# EasyEDA schematic Class D Audio Amplifier on TPA3255 ChipDip.json
TITLE: Sheet_1; REV: 1.0; Date: 2019-03-31; Sheet: 1/1; Drawn By: Dmitry-Chernikov; Company: Your Company
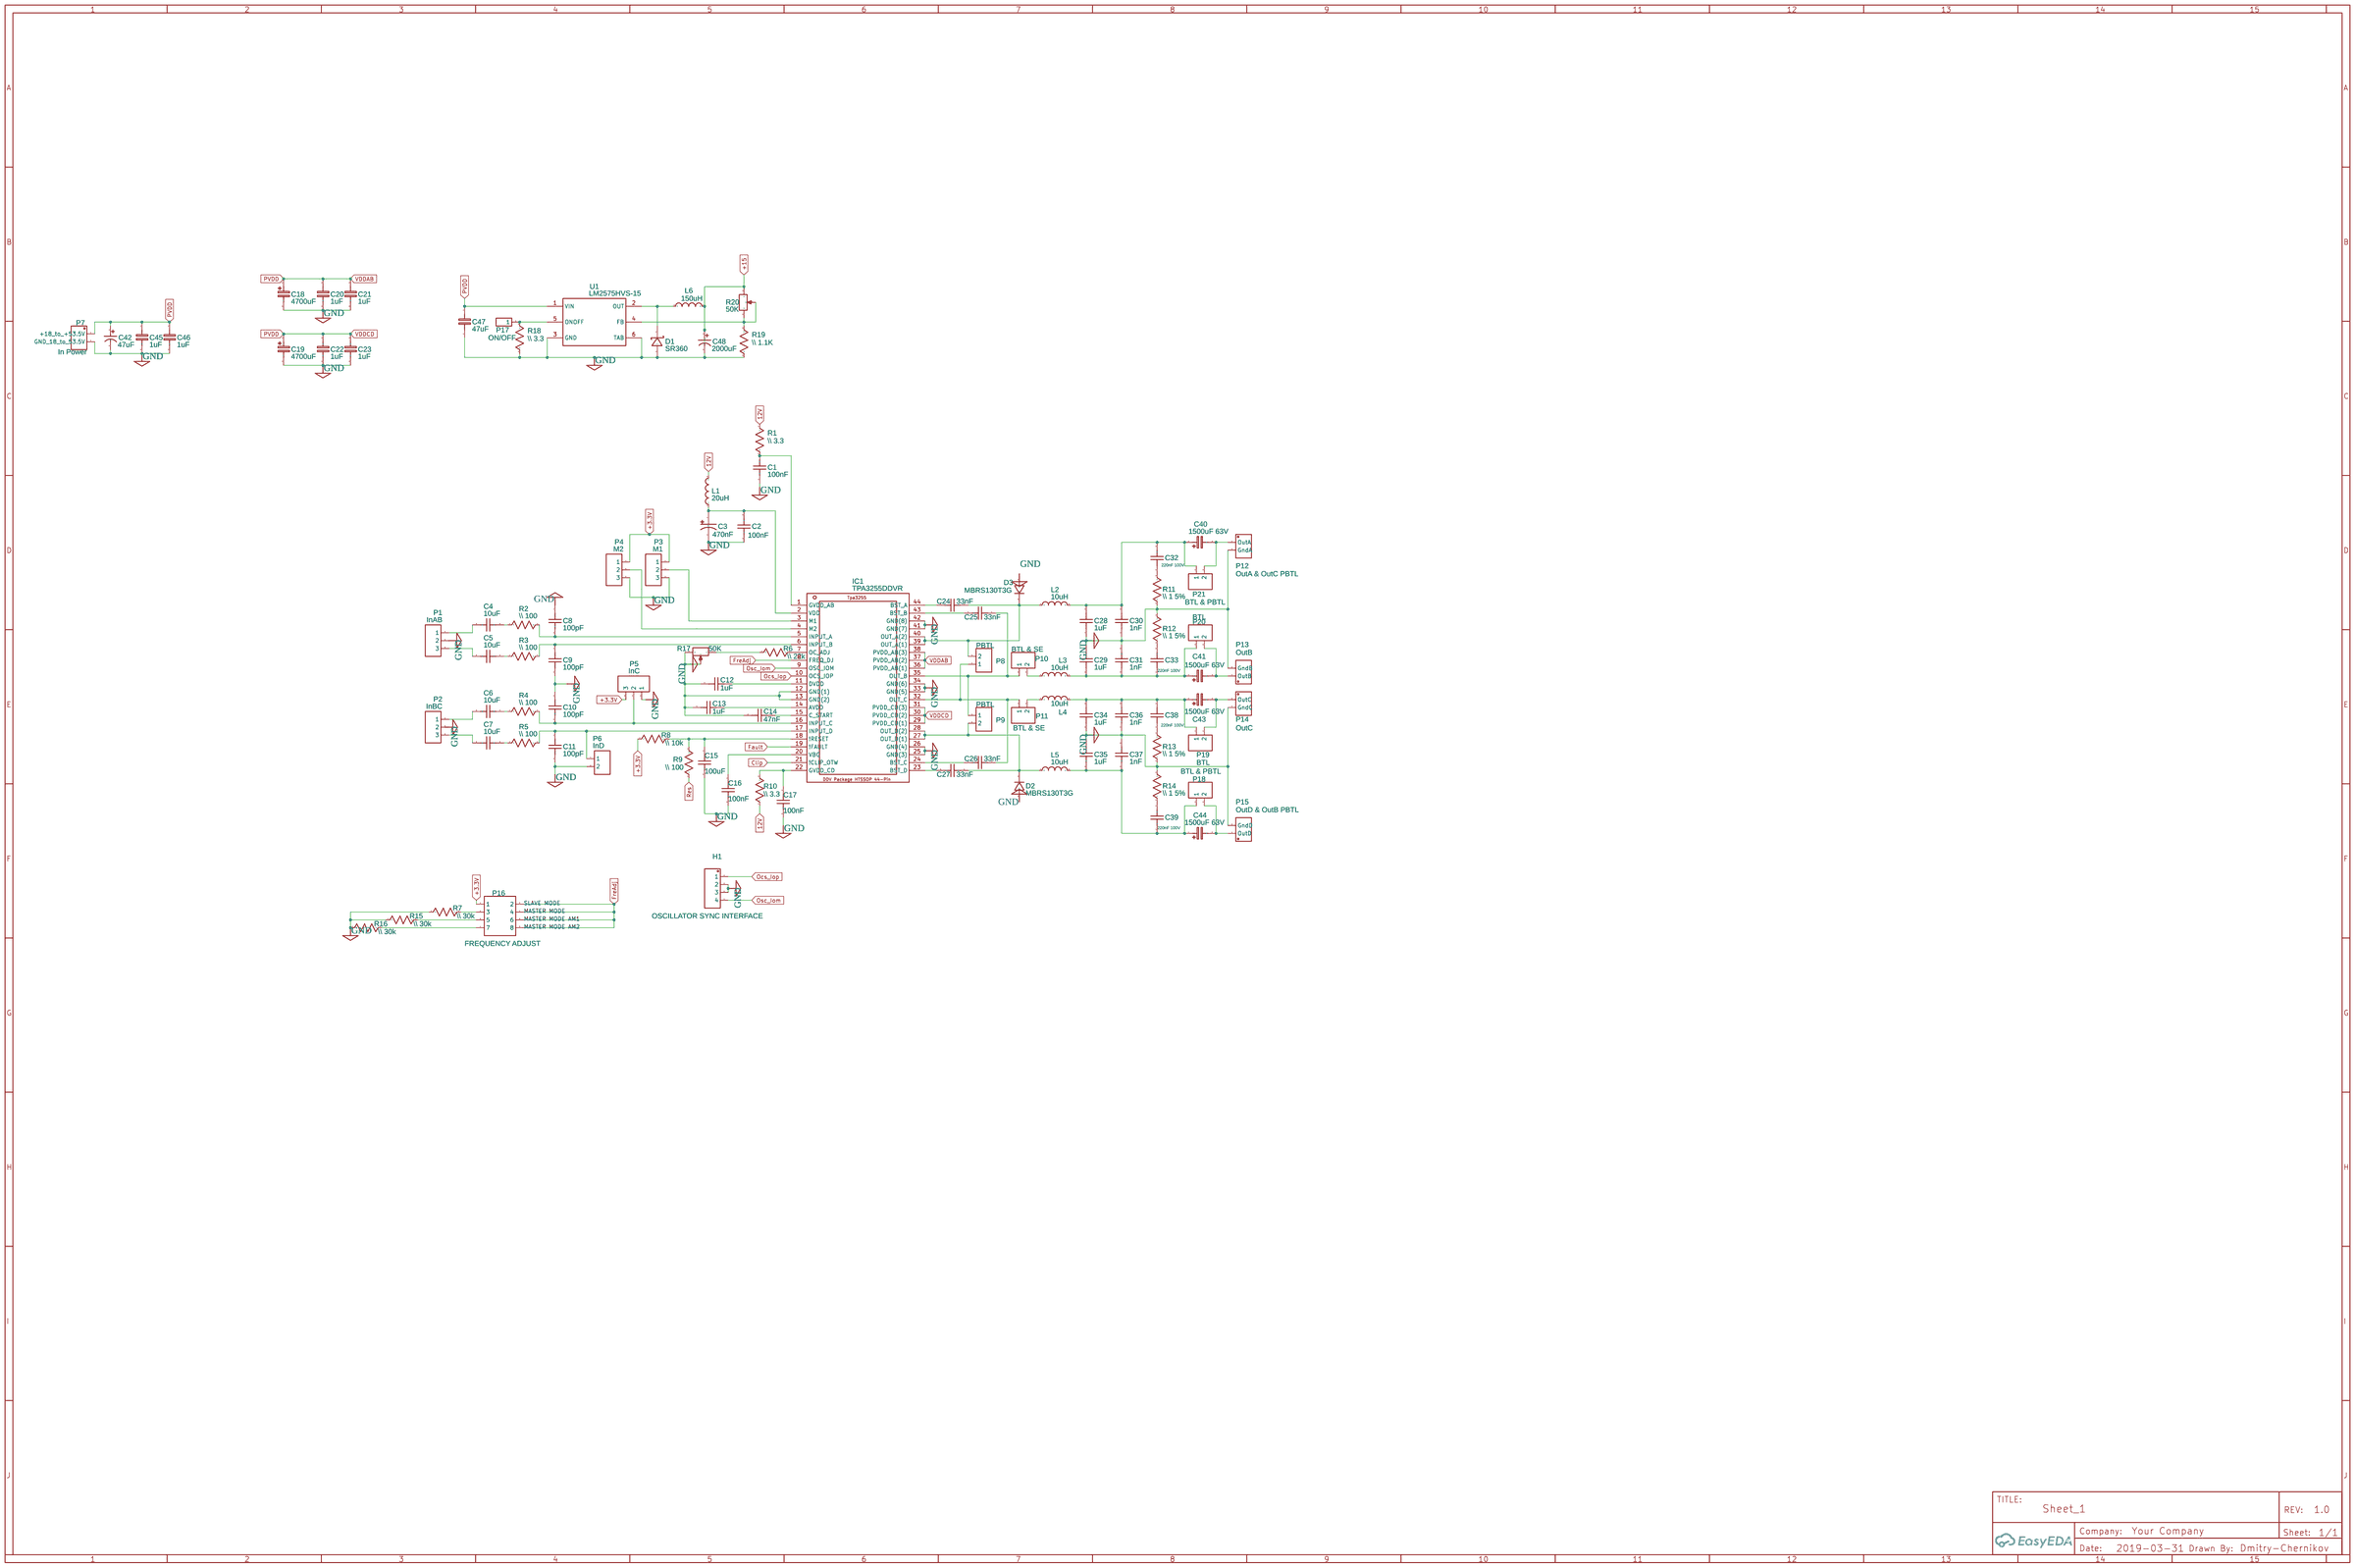
[diagram p0: schematic sheet]

## Parts
C1  100nF  [CAP_RAD-0.2_AND_SMD_0805]
C2  100nF  [CAP_RAD-0.2_AND_SMD_0805]
C3  470nF  [CAP-D3.0XF1.5]
C4  10uF  [CAP_RAD-0.2_AND_SMD_0805]
C5  10uF  [CAP_RAD-0.2_AND_SMD_0805]
C6  10uF  [CAP_RAD-0.2_AND_SMD_0805]
C7  10uF  [CAP_RAD-0.2_AND_SMD_0805]
C8  100pF  [CAP_RAD-0.2_AND_SMD_0805]
C9  100pF  [CAP_RAD-0.2_AND_SMD_0805]
C10  100pF  [CAP_RAD-0.2_AND_SMD_0805]
C11  100pF  [CAP_RAD-0.2_AND_SMD_0805]
C12  1uF  [CAP_RAD-0.2_AND_SMD_0805]
C13  1uF  [CAP_RAD-0.2_AND_SMD_0805]
C14  47nF  [CAP_RAD-0.2_AND_SMD_0805]
C15  100uF  [CAP_RAD-0.2_AND_SMD_0805]
C16  100nF  [CAP_RAD-0.2_AND_SMD_0805]
C17  100nF  [CAP_RAD-0.2_AND_SMD_0805]
C18  4700uF  [SLPX472M080H3P3_85_°C_SNAP-IN_ALUMINUM_ELECTROLYTIC]
C19  4700uF  [SLPX472M080H3P3_85_°C_SNAP-IN_ALUMINUM_ELECTROLYTIC]
C20  1uF  [CAP_1210_CL-1210,Y5V,K,101]
C21  1uF  [CAP_1210_CL-1210,Y5V,K,101]
C22  1uF  [CAP_1210_CL-1210,Y5V,K,101]
C23  1uF  [CAP_1210_CL-1210,Y5V,K,101]
C24  33nF  [CAP_RAD-0.2_AND_SMD_0805]
C25  33nF  [CAP_RAD-0.2_AND_SMD_0805]
C26  33nF  [CAP_RAD-0.2_AND_SMD_0805]
C27  33nF  [CAP_RAD-0.2_AND_SMD_0805]
C28  1uF  [К78-19]
C29  1uF  [К78-19]
C30  1nF  [RAD-0.2_SMD_2106]
C31  1nF  [RAD-0.2_SMD_2106]
C32  220nF 100V  [CAP_0.2_AND_0603]
C33  220nF 100V  [CAP_0.2_AND_0603]
C34  1uF  [К78-19]
C35  1uF  [К78-19]
C36  1nF  [RAD-0.2_SMD_2106]
C37  1nF  [RAD-0.2_SMD_2106]
C38  220nF 100V  [CAP_0.2_AND_0603]
C39  220nF 100V  [CAP_0.2_AND_0603]
C40  1500uF 63V  [CAP-D18,16-F7.5, 5-DN0.8,0.6]
C41  1500uF 63V  [CAP-D18,16-F7.5, 5-DN0.8,0.6]
C42  47uF  [CAP-D8.0XH11.5 D6.3XH11 SMD-D8XH10.5 D6.3XH7.7]
C43  1500uF 63V  [CAP-D18,16-F7.5, 5-DN0.8,0.6]
C44  1500uF 63V  [CAP-D18,16-F7.5, 5-DN0.8,0.6]
C45  1uF  [CAP_1206_CL_1206]
C46  1uF  [CAP_0.2_AND_0603]
C47  47uF  [CAP_1210_CL-1210,Y5V,K,101]
C48  2000uF  [CAP-D8.0XH11.5 D6.3XH11 SMD-D8XH10.5 D6.3XH7.7]
D1  SR360  [SR360_DO-27_(DO-201AD)]
D2  MBRS130T3G  [SMB(DO-214AA)]
D3  MBRS130T3G  [SMB(DO-214AA)]
H1  OSCILLATOR SYNC INTERFACE  [DIP-1X4P-2.54MM-M]
IC1  TPA3255DDVR  [TPA3255 HTSSOP44 POWERPAD IS A TRADEMARK OF TEXAS INSTRUMENTS]
L1  20uH  [AXIAL-0.4]
L2  10uH  [IND_ALTNC]
L3  10uH  [IND_ALTNC]
L4  10uH  [IND_ALTNC]
L5  10uH  [IND_ALTNC]
L6  150uH  [SRR1208-151YL]
P1  InAB  [HDR-3X1/2.54]
P2  InBC  [HDR-3X1/2.54]
P3  M1  [HDR-3X1/2.54]
P4  M2  [HDR-3X1/2.54]
P5  InC  [HDR-3X1/2.54]
P6  InD  [HDR-1X2/2.54]
P7  In Power  [WJ2EDGVC-5.08-2P]
P8  PBTL  [WJ2EDGVC-5.08-2P]
P9  PBTL  [WJ2EDGVC-5.08-2P]
P10  BTL & SE  [WJ2EDGVC-5.08-2P]
P11  BTL & SE  [WJ2EDGVC-5.08-2P]
P12  OutA & OutC PBTL  [WJ2EDGVC-5.08-2P]
P13  OutB  [WJ2EDGVC-5.08-2P]
P14  OutC  [WJ2EDGVC-5.08-2P]
P15  OutD & OutB PBTL  [WJ2EDGVC-5.08-2P]
P16  FREQUENCY ADJUST  [HDR-4X2/2.54]
P17  ON/OFF  [HDR-1X1/2.54]
P18  BTL & PBTL  [WJ2EDGVC-5.08-2P]
P19  BTL  [WJ2EDGVC-5.08-2P]
P20  BTL  [WJ2EDGVC-5.08-2P]
P21  BTL & PBTL  [WJ2EDGVC-5.08-2P]
R1  \\ 3.3  [RES_AXIAL-0.3_AND_SMD_0805]
R2  \\ 100  [RES_AXIAL-0.3_AND_SMD_0805]
R3  \\ 100  [RES_AXIAL-0.3_AND_SMD_0805]
R4  \\ 100  [RES_AXIAL-0.3_AND_SMD_0805]
R5  \\ 100  [RES_AXIAL-0.3_AND_SMD_0805]
R6  \\ 22k  [RES_AXIAL-0.3_AND_SMD_0805]
R7  \\ 30k  [RES_AXIAL-0.3_AND_SMD_0805]
R8  \\ 10k  [RES_AXIAL-0.3_AND_SMD_0805]
R9  \\ 100  [RES_AXIAL-0.3_AND_SMD_0805]
R10  \\ 3.3  [RES_AXIAL-0.3_AND_SMD_0805]
R11  \\ 1 5%  [RES_AXIAL_0.3_SMD_0603]
R12  \\ 1 5%  [RES_AXIAL_0.3_SMD_0603]
R13  \\ 1 5%  [RES_AXIAL_0.3_SMD_0603]
R14  \\ 1 5%  [RES_AXIAL_0.3_SMD_0603]
R15  \\ 30k  [RES_AXIAL-0.3_AND_SMD_0805]
R16  \\ 30k  [RES_AXIAL-0.3_AND_SMD_0805]
R17  50K  [RES-ADJ_3214 3224 3296 3266]
R18  \\ 3.3  [RES_AXIAL-0.3_AND_SMD_0805]
R19  \\ 1.1K  [RES_AXIAL-0.3_AND_SMD_0805]
R20  50K  [RES-ADJ_3214 3224 3296 3266]
U1  LM2575HVS-15  [LM2575S-15_TO-263_TO-220]

## Library data of the parts
C1 C2 C4-C17 C24-C39 = Cap_RAD-0.2_US: Manufacturer Part: ?
C3 = Cap_Electrolytic(TH)_D3.0XF1.5_US: Manufacturer Part: ?
C18 C19 C40 C41 C43 C44 = Cap_Electrolytic(TH)_D8.0XF3.5_EU: Contributor: EasyEDA; Manufacturer Part: ?
C20-C23 C45-C47 = Cap_1206_EU: Manufacturer Part: ?
C42 C48 = 47uF 63V 6.3*11: Supplier: LCSC; Manufacturer: ValuePro; Supplier Part: C45673
D1 = -: Supplier: LCSC; Manufacturer: ON; Manufacturer Part: MBR0520LT1G; image: //image.lceda.cn/szlcsc/C23848.jpg; Supplier Part: C23848
D2 D3 = -: Supplier Part: C146717; Supplier: LCSC; Manufacturer: ON; Contributor: LCSC; LCSC Assembly: Yes; SMT Type: Extend
H1 = -: Supplier: LCSC; Manufacturer: Ckmtw; Manufacturer Part: 210S-1*4P L=11.6MMGold-plated black; Contributor: LCSC; Supplier Part: C124378
IC1 = -: 315W Stereo  600W Mono PurePath Ultra-HD, Analog-In Class-D Amplifier; Contributor: Dmitry-Chernikov; Manufacturer Part: TPA3255 DDV Package HTSSOP 44-Pin; Supplier: Texas Instruments; link: https://www.ti.com/lit/ds/symlink/tpa3255.pdf
L1 = Inductor_AXIAL-0.4_US: Manufacturer Part: ?
L2-L5 = Inductor_AXIAL-0.6_US: Manufacturer Part: ?
L6 = Inductor_AXIAL-0.4_US: Manufacturer Part: ?; Supplier: BOURNS
P1-P5 = -: Supplier: LCSC; Manufacturer: BOOMELE; Manufacturer Part: Header2.54mm 1*3P; image: //image.lceda.cn/szlcsc/C49257.jpg; Supplier Part: C49257
P6 P8-P11 P18-P21 = -: Supplier: LCSC; Manufacturer: BOOMELE; Manufacturer Part: 2.54-1*2PFemale; image: //image.lceda.cn/szlcsc/C49661.jpg; Supplier Part: C49661
P7 P12-P15 = -: Supplier: LCSC; Manufacturer: ReliaPro; image: //image.lceda.cn/szlcsc/C8445.jpg; Supplier Part: C8445
P16 = -: Supplier: LCSC; Manufacturer: ReliaPro; Manufacturer Part: Header2X4P 2.54mm; image: http://image.lceda.cn/szlcsc/C58363.jpg; Supplier Part: C124386
P17 = -: Supplier: LCSC; Manufacturer: ReliaPro; Manufacturer Part: Header-Male-2.54_1x1; Supplier Part: C81276
R1-R16 R18 R19 = Res_AXIAL-0.3(1/8W)_US: Manufacturer Part: ?
R17 R20 = 3314J-1-503E: Supplier: LCSC; Manufacturer: BOURNS; Supplier Part: C50895
U1 = -: Supplier: LCSC; Manufacturer: TI; Supplier Part: C62077

## Nets
12V: L1.2 R1.1 R10.1
+3.3V: P3.1 P4.1 P5.3 P16.1 R8.1
GND: C1.1 C2.1 C3.2 C8.1 C9.2 C10.1 C11.2 C12.2 C13.2 C14.2 C15.2 C16.2 C17.2 C18.2 C19.2 C20.2 C21.2 C22.2 C23.2 C28.1 C29.2 C30.1 C31.2 C34.1 C35.2 C36.1 C37.2 C42.2 C45.2 C46.2 C47.2 C48.2 D1.1(A) D2.1 D3.1 H1.2 H1.3 IC1.12(GND(1)) IC1.13(GND(2)) IC1.25(GND(3)) IC1.26(GND(4)) IC1.33(GND(5)) IC1.34(GND(6)) IC1.41(GND(7)) IC1.42(GND(8)) P1.2 P2.2 P3.3 P4.3 P5.1 P6.2 P7.2(GND 18 to 53.5V) P12.2(GndA) P13.2(GndB) P14.2(GndC) P15.2(GndD) R7.1 R11.1 R12.2 R13.1 R14.2 R15.1 R16.1 R17.2 R17.3 R18.2 R19.2 U1.3(GND) U1.6(TAB)
PVDD: C18.1 C19.1 C20.1 C21.1 C22.1 C23.1 C42.1 C45.1 C46.1 C47.1 IC1.29(PVDD_CD(1)) IC1.30(PVDD_CD(2)) IC1.31(PVDD_CD(3)) IC1.36(PVDD_AB(1)) IC1.37(PVDD_AB(2)) IC1.38(PVDD_AB(3)) P7.1(+18 to +53.5V) U1.1(VIN)
+15: C48.1 L6.2 R20.1
Clip: IC1.21(!CLIP_OTW)
Fault: IC1.19(!FAULT)
FreAdj: IC1.8(FREQ_DJ) P16.2 P16.4 P16.6 P16.8
Ocs_Iop: H1.1 IC1.10(OCS_IOP)
Osc_Iom: H1.4 IC1.9(OSC_IOM)
Res: R9.1
Net-(C1-2): C1.2 IC1.1(GVDD_AB) R1.2
Net-(C2-2): C2.2 C3.1 IC1.2(VDD) L1.1
Net-(C4-1): C4.1 R2.1
Net-(C4-2): C4.2 P1.1
Net-(C5-1): C5.1 R3.1
Net-(C5-2): C5.2 P1.3
Net-(C6-1): C6.1 R4.1
Net-(C6-2): C6.2 P2.1
Net-(C7-1): C7.1 R5.1
Net-(C7-2): C7.2 P2.3
Net-(C8-2): C8.2 IC1.5(INPUT_A) R2.2
Net-(C9-1): C9.1 IC1.6(INPUT_B) R3.2
Net-(C10-2): C10.2 IC1.16(INPUT_C) P5.2 R4.2
Net-(C11-1): C11.1 IC1.17(INPUT_D) P6.1 R5.2
Net-(C12-1): C12.1 IC1.11(DVDD)
Net-(C13-1): C13.1 IC1.14(AVDD)
Net-(C14-1): C14.1 IC1.15(C_START)
Net-(C15-1): C15.1 IC1.18(!RESET) R8.2 R9.2
Net-(C16-1): C16.1 IC1.20(VBG)
Net-(C17-1): C17.1 IC1.22(GVDD_CD) R10.2
Net-(C24-1): C24.1 D3.2 IC1.39(OUT_A(1)) IC1.40(OUT_A(2)) L2.1 P8.2
Net-(C24-2): C24.2 IC1.44(BST_A)
Net-(C25-1): C25.1 IC1.35(OUT_B) P9.1 P10.1
Net-(C25-2): C25.2 IC1.43(BST_B)
Net-(C26-1): C26.1 IC1.32(OUT_C) P8.1 P11.1
Net-(C26-2): C26.2 IC1.24(BST_C)
Net-(C27-1): C27.1 D2.2 IC1.27(OUT_D(1)) IC1.28(OUT_D(2)) L5.1 P9.2
Net-(C27-2): C27.2 IC1.23(BST_D)
Net-(C28-2): C28.2 C30.2 C32.2 C40.1 L2.2 P21.1
Net-(C29-1): C29.1 C31.1 C33.1 C41.1 L3.2 P20.1
Net-(C32-1): C32.1 R11.2
Net-(C33-2): C33.2 R12.1
Net-(C34-2): C34.2 C36.2 C38.2 C43.1 L4.2 P19.1
Net-(C35-1): C35.1 C37.1 C39.1 C44.1 L5.2 P18.1
Net-(C38-1): C38.1 R13.2
Net-(C39-2): C39.2 R14.1
Net-(C40-2): C40.2 P12.1(OutA) P21.2
Net-(C41-2): C41.2 P13.1(OutB) P20.2
Net-(C43-2): C43.2 P14.1(OutC) P19.2
Net-(C44-2): C44.2 P15.1(OutD) P18.2
Net-(D1-2): D1.2(K) L6.1 U1.2(OUT)
Net-(IC1-3): IC1.3(M1) P3.2
Net-(IC1-4): IC1.4(M2) P4.2
Net-(IC1-7): IC1.7(OC_ADJ) R6.2
Net-(L3-1): L3.1 P10.2
Net-(L4-1): L4.1 P11.2
Net-(P16-3): P16.3 R7.2
Net-(P16-5): P16.5 R15.2
Net-(P16-7): P16.7 R16.2
Net-(P17-1): P17.1 R18.1 U1.5(ONOFF)
Net-(R6-1): R6.1 R17.1
Net-(R19-1): R19.1 R20.2 R20.3 U1.4(FB)
